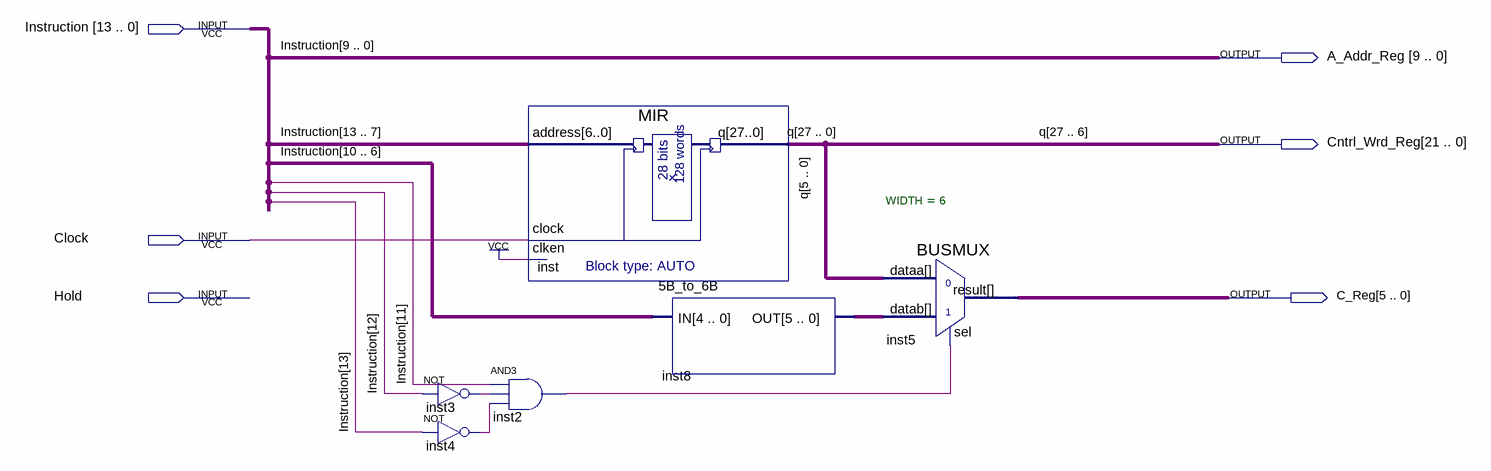
[diagram p0: schematic sheet]
// Quartus schematic Decode_Test.bdf as structural Verilog: 6 symbols, 6 pins
module Decode_Test (
  input  [13:0] Instruction,
  input  Clock,
  input  Hold,
  output [9:0] A_Addr_Reg,
  output [21:0] Cntrl_Wrd_Reg,
  output [5:0] C_Reg
);

  wire inst2_out, inst3_out, inst4_out;
  wire [5:0] inst8_out, q;

  not inst3 (inst3_out, Instruction[12]);
  not inst4 (inst4_out, Instruction[13]);
  MIR inst (.address(Instruction[13:7]), .clock(Clock), .clken(1'b1), .q({Cntrl_Wrd_Reg, q}));
  and inst2 (inst2_out, Instruction[11], inst3_out, inst4_out);
  \5B_to_6B  inst8 (.IN(Instruction[10:6]), .OUT(inst8_out));
  BUSMUX #(.WIDTH(6)) inst5 (.datab(inst8_out), .sel(inst2_out), .dataa(q), .result(C_Reg));

  assign A_Addr_Reg = Instruction[9:0];

  // Other names for the same wires on the sheet: q[27:6] = Cntrl_Wrd_Reg
endmodule
